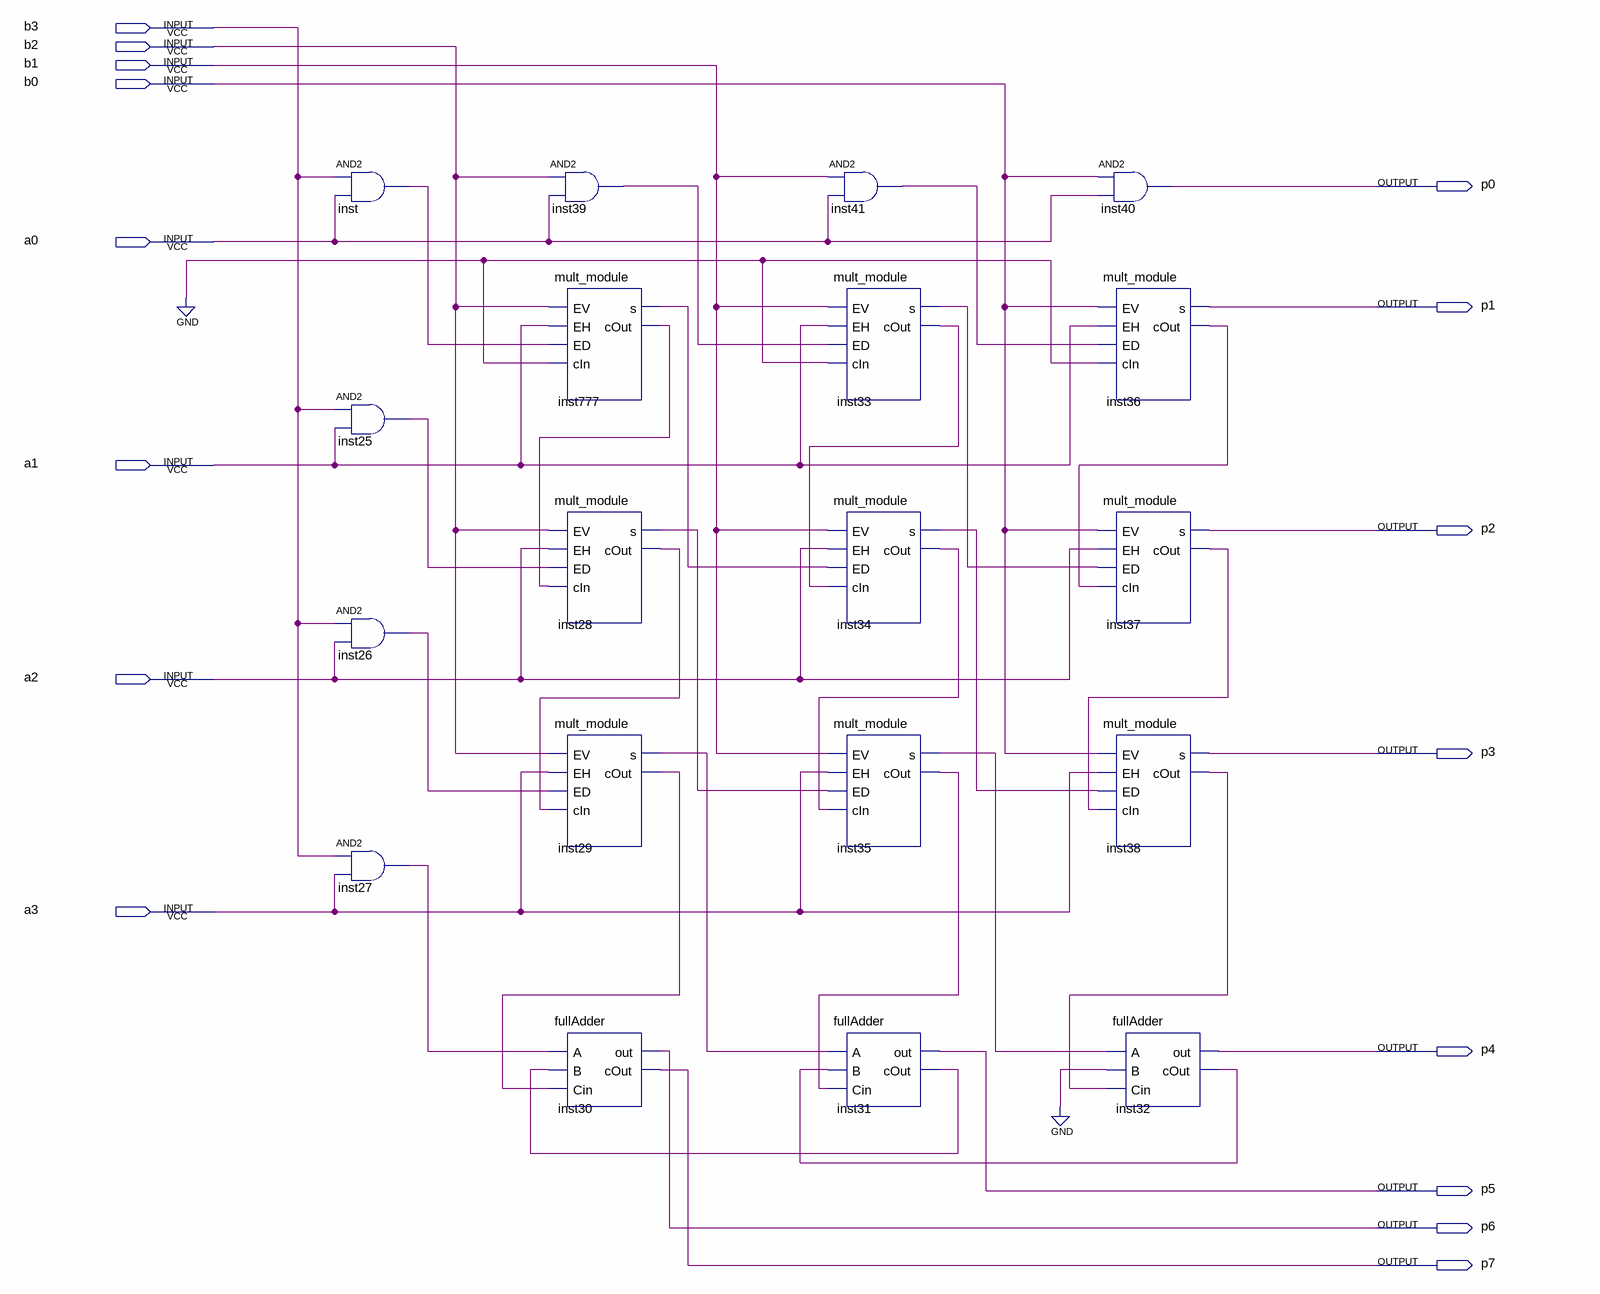
[diagram p0: schematic sheet]
// Quartus schematic multiplier.bdf as structural Verilog: 19 symbols, 16 pins
module multiplier (
  input  b3,
  input  b2,
  input  b1,
  input  b0,
  input  a0,
  input  a1,
  input  a2,
  input  a3,
  output p0,
  output p1,
  output p2,
  output p3,
  output p4,
  output p5,
  output p6,
  output p7
);

  wire inst25_out, inst26_out, inst27_out, inst28_cout, inst28_s, inst29_cout, inst29_s, inst31_cout,
       inst32_cout, inst33_cout, inst33_s, inst34_cout, inst34_s, inst35_cout, inst35_s, inst36_cout,
       inst37_cout, inst38_cout, inst39_out, inst41_out, inst777_cout, inst777_s, inst_out;

  and inst (inst_out, b3, a0);
  and inst25 (inst25_out, b3, a1);
  and inst26 (inst26_out, b3, a2);
  and inst27 (inst27_out, b3, a3);
  and inst39 (inst39_out, b2, a0);
  mult_module inst777 (.EV(b2), .EH(a1), .ED(inst_out), .cIn(1'b0), .s(inst777_s), .cOut(inst777_cout));
  mult_module inst28 (.EV(b2), .EH(a2), .ED(inst25_out), .cIn(inst777_cout), .s(inst28_s), .cOut(inst28_cout));
  mult_module inst29 (.EV(b2), .EH(a3), .ED(inst26_out), .cIn(inst28_cout), .s(inst29_s), .cOut(inst29_cout));
  fullAdder inst30 (.A(inst27_out), .B(inst31_cout), .Cin(inst29_cout), .out(p6), .cOut(p7));
  and inst41 (inst41_out, b1, a0);
  mult_module inst33 (.EV(b1), .EH(a1), .ED(inst39_out), .cIn(1'b0), .s(inst33_s), .cOut(inst33_cout));
  mult_module inst34 (.EV(b1), .EH(a2), .ED(inst777_s), .cIn(inst33_cout), .s(inst34_s), .cOut(inst34_cout));
  mult_module inst35 (.EV(b1), .EH(a3), .ED(inst28_s), .cIn(inst34_cout), .s(inst35_s), .cOut(inst35_cout));
  fullAdder inst31 (.A(inst29_s), .B(inst32_cout), .Cin(inst35_cout), .out(p5), .cOut(inst31_cout));
  and inst40 (p0, b0, a0);
  mult_module inst36 (.EV(b0), .EH(a1), .ED(inst41_out), .cIn(1'b0), .s(p1), .cOut(inst36_cout));
  mult_module inst37 (.EV(b0), .EH(a2), .ED(inst33_s), .cIn(inst36_cout), .s(p2), .cOut(inst37_cout));
  mult_module inst38 (.EV(b0), .EH(a3), .ED(inst34_s), .cIn(inst37_cout), .s(p3), .cOut(inst38_cout));
  fullAdder inst32 (.A(inst35_s), .B(1'b0), .Cin(inst38_cout), .out(p4), .cOut(inst32_cout));
endmodule
